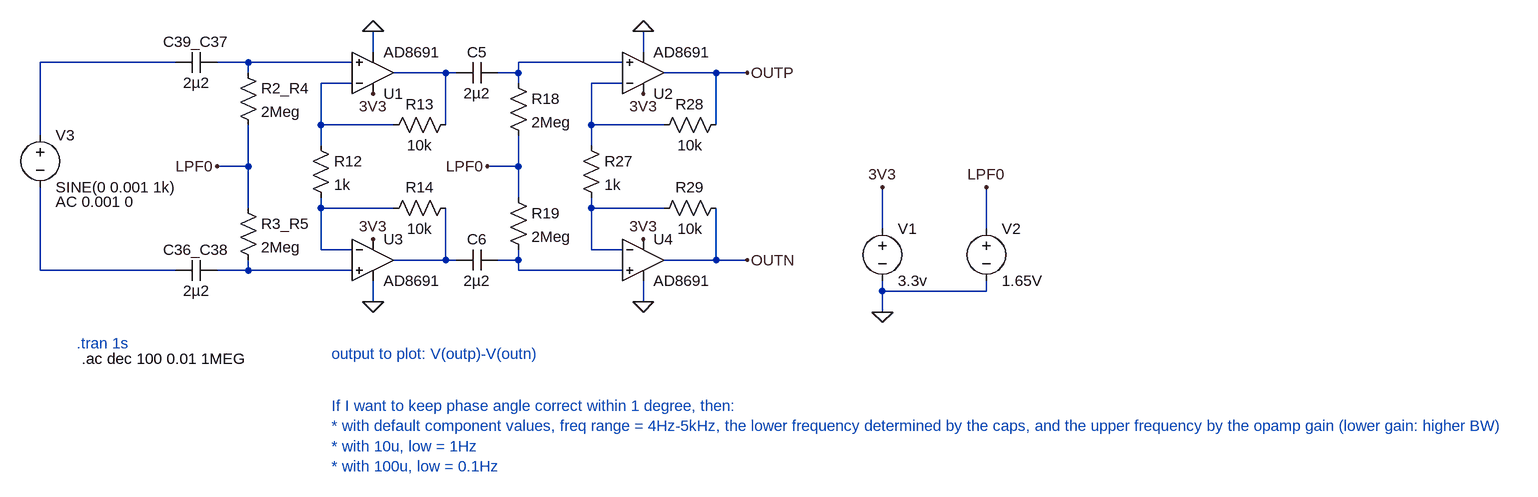
[diagram p0: schematic CN0510_input.asc]
CN0510_input.asc, the LTspice schematic file:
Version 4
SHEET 1 2040 784
WIRE 272 160 272 128
WIRE 688 160 688 128
WIRE -32 176 -240 176
WIRE 80 176 32 176
WIRE 240 176 80 176
WIRE 656 176 496 176
WIRE 80 192 80 176
WIRE 384 192 304 192
WIRE 400 192 384 192
WIRE 496 192 496 176
WIRE 496 192 464 192
WIRE 800 192 720 192
WIRE 848 192 800 192
WIRE 240 208 192 208
WIRE 496 208 496 192
WIRE 656 208 608 208
WIRE 192 272 192 208
WIRE 304 272 192 272
WIRE 384 272 384 192
WIRE 608 272 608 208
WIRE 720 272 608 272
WIRE 800 272 800 192
WIRE -240 288 -240 176
WIRE 192 304 192 272
WIRE 608 304 608 272
WIRE 80 336 80 272
WIRE 80 336 32 336
WIRE 496 336 496 288
WIRE 496 336 448 336
WIRE 496 384 496 336
WIRE 80 400 80 336
WIRE 192 400 192 384
WIRE 304 400 192 400
WIRE 608 400 608 384
WIRE 720 400 608 400
WIRE 1056 432 1056 368
WIRE 1216 432 1216 368
WIRE 192 464 192 400
WIRE 240 464 192 464
WIRE 608 464 608 400
WIRE 656 464 608 464
WIRE 384 480 384 400
WIRE 384 480 304 480
WIRE 400 480 384 480
WIRE 496 480 496 464
WIRE 496 480 464 480
WIRE 800 480 800 400
WIRE 800 480 720 480
WIRE 848 480 800 480
WIRE -240 496 -240 368
WIRE -32 496 -240 496
WIRE 80 496 80 480
WIRE 80 496 32 496
WIRE 240 496 80 496
WIRE 496 496 496 480
WIRE 656 496 496 496
WIRE 1056 528 1056 512
WIRE 1216 528 1216 512
WIRE 1216 528 1056 528
WIRE 272 544 272 512
WIRE 688 544 688 512
WIRE 1056 560 1056 528
FLAG 1056 560 0
FLAG 1056 368 3V3
FLAG 1216 368 LPF0
FLAG 448 336 LPF0
FLAG 32 336 LPF0
FLAG 688 544 0
FLAG 272 544 0
FLAG 272 128 0
FLAG 688 128 0
FLAG 688 224 3V3
FLAG 272 224 3V3
FLAG 688 448 3V3
FLAG 272 448 3V3
FLAG 848 192 OUTP
FLAG 848 480 OUTN
SYMBOL OpAmps/AD8691 272 256 M180
SYMATTR InstName U1
SYMBOL OpAmps/AD8691 688 256 M180
SYMATTR InstName U2
SYMBOL OpAmps/AD8691 272 416 R0
SYMATTR InstName U3
SYMBOL OpAmps/AD8691 688 416 R0
SYMATTR InstName U4
SYMBOL res 816 256 R90
WINDOW 0 0 56 VBottom 2
WINDOW 3 32 56 VTop 2
SYMATTR InstName R28
SYMATTR Value 10k
SYMBOL res 816 384 R90
WINDOW 0 0 56 VBottom 2
WINDOW 3 32 56 VTop 2
SYMATTR InstName R29
SYMATTR Value 10k
SYMBOL res 400 384 R90
WINDOW 0 0 56 VBottom 2
WINDOW 3 32 56 VTop 2
SYMATTR InstName R14
SYMATTR Value 10k
SYMBOL res 400 256 R90
WINDOW 0 0 56 VBottom 2
WINDOW 3 32 56 VTop 2
SYMATTR InstName R13
SYMATTR Value 10k
SYMBOL res 592 288 R0
SYMATTR InstName R27
SYMATTR Value 1k
SYMBOL res 176 288 R0
SYMATTR InstName R12
SYMATTR Value 1k
SYMBOL res 480 368 R0
SYMATTR InstName R19
SYMATTR Value 2Meg
SYMBOL res 480 192 R0
SYMATTR InstName R18
SYMATTR Value 2Meg
SYMBOL res 64 176 R0
SYMATTR InstName R2_R4
SYMATTR Value 2Meg
SYMBOL res 64 384 R0
SYMATTR InstName R3_R5
SYMATTR Value 2Meg
SYMBOL cap 464 464 R90
WINDOW 0 0 32 VBottom 2
WINDOW 3 32 32 VTop 2
SYMATTR InstName C6
SYMATTR Value 2µ2
SYMBOL cap 464 176 R90
WINDOW 0 0 32 VBottom 2
WINDOW 3 32 32 VTop 2
SYMATTR InstName C5
SYMATTR Value 2µ2
SYMBOL cap 32 160 R90
WINDOW 0 0 32 VBottom 2
WINDOW 3 32 32 VTop 2
SYMATTR InstName C39_C37
SYMATTR Value 2µ2
SYMBOL cap 32 480 R90
WINDOW 0 0 32 VBottom 2
WINDOW 3 32 32 VTop 2
SYMATTR InstName C36_C38
SYMATTR Value 2µ2
SYMBOL voltage 1056 416 R0
SYMATTR InstName V1
SYMATTR Value 3.3v
SYMBOL voltage 1216 416 R0
SYMATTR InstName V2
SYMATTR Value 1.65V
SYMBOL voltage -240 272 R0
WINDOW 123 24 118 Left 2
SYMATTR InstName V3
SYMATTR Value SINE(0 0.001 1k)
SYMATTR Value2 AC 0.001 0
TEXT -184 608 Left 2 ;.tran 1s
TEXT -176 632 Left 2 !.ac dec 100 0.01 1MEG
TEXT 208 624 Left 2 ;output to plot: V(outp)-V(outn)
TEXT 208 704 Left 2 ;If I want to keep phase angle correct within 1 degree, then:\n* with default component values, freq range = 4Hz-5kHz, the lower frequency determined by the caps, and the upper frequency by the opamp gain (lower gain: higher BW)\n* with 10u, low = 1Hz\n* with 100u, low = 0.1Hz

The netlist it stands for:
* CN0510_input.asc
XU1 N002 N005 3V3 0 N004 AD8691  ; pins In+ In- V+ V- OUT
XU2 N003 N006 3V3 0 OUTP AD8691  ; pins In+ In- V+ V- OUT
XU3 N012 N007 3V3 0 N009 AD8691  ; pins In+ In- V+ V- OUT
XU4 N010 N008 3V3 0 OUTN AD8691  ; pins In+ In- V+ V- OUT
R28 OUTP N006 10k
R29 OUTN N008 10k
R14 N009 N007 10k
R13 N004 N005 10k
R27 N006 N008 1k
R12 N005 N007 1k
R19 LPF0 N010 2Meg
R18 N003 LPF0 2Meg
R2_R4 N002 LPF0 2Meg
R3_R5 LPF0 N012 2Meg
C6 N010 N009 2µ2
C5 N003 N004 2µ2
C39_C37 N002 N001 2µ2
C36_C38 N012 N011 2µ2
V1 3V3 0 3.3v
V2 LPF0 0 1.65V
V3 N001 N011 SINE(0 0.001 1k) AC 0.001 0
* .tran 1s
.ac dec 100 0.01 1MEG
* output to plot: V(outp)-V(outn)
* If I want to keep phase angle correct within 1 degree, then:
* * with default component values, freq range = 4Hz-5kHz, the lower frequency determined by the caps, and the upper frequency by the opamp gain (lower gain: higher BW)
* * with 10u, low = 1Hz
* * with 100u, low = 0.1Hz
.backanno
.end